# Altium schematic sheet Sheet1.SchDoc
size A3
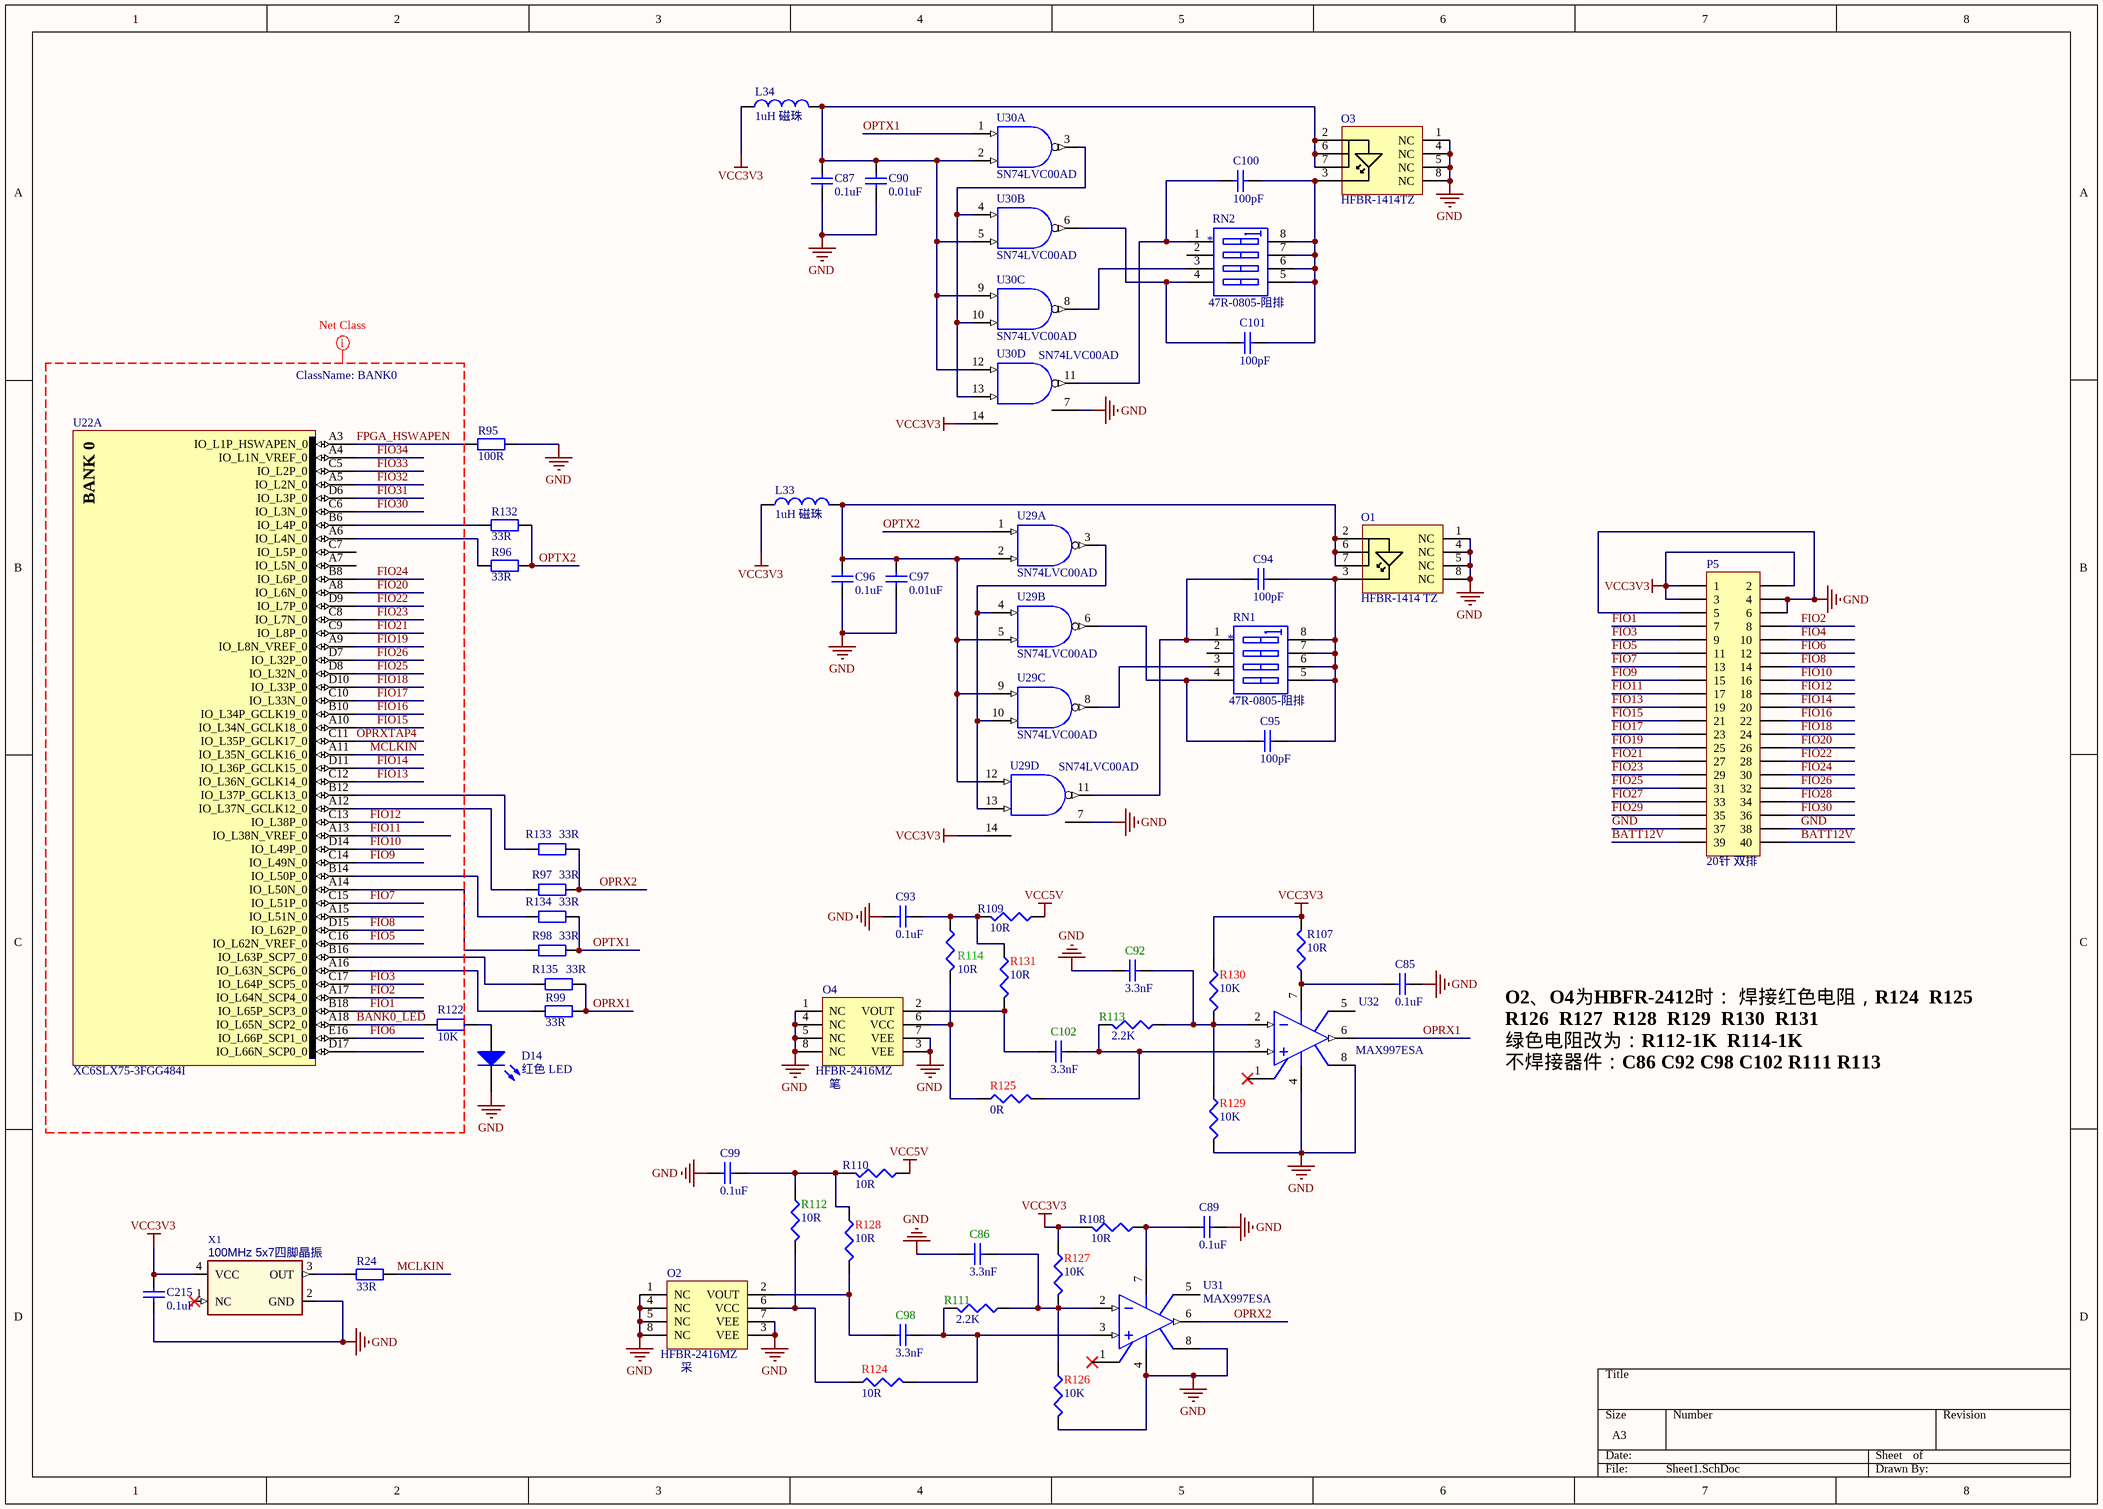
[diagram p0: Sheet1.SchDoc]

## Parts
C85  0.1uF  [0603C]
C86  3.3nF  [0603C]
C87  0.1uF  [0603C]
C89  0.1uF  [0603C]
C90  0.01uF  [0603C]
C92  3.3nF  [0603C]
C93  0.1uF  [0603C]
C94  100pF  [0603C]
C95  100pF  [0603C]
C96  0.1uF  [0603C]
C97  0.01uF  [0603C]
C98  3.3nF  [0603C]
C99  0.1uF  [0603C]
C100  100pF  [0603C]
C101  100pF  [0603C]
C102  3.3nF  [0603C]
C215  0.1uF  [0603C]
D14  红色 LED  [0805LED]
L33  1uH 磁珠  [1206L]
L34  1uH 磁珠  [1206L]
O1  HFBR-1414 TZ  [OPT]
O2  HFBR-2416MZ  [OPT]
O3  HFBR-1414TZ  [OPT]
O4  HFBR-2416MZ  [OPT]
P5  20针 双排  [HEAD2V40]
R24  33R  [0603R]
R95  100R  [0603R]
R96  33R  [0603R]
R97  33R  [0603R]
R98  33R  [0603R]
R99  33R  [0603R]
R107  10R  [0603R]
R108  10R  [0603R]
R109  10R  [0603R]
R110  10R  [0603R]
R111  2.2K  [0603R]
R112  10R  [0603R]
R113  2.2K  [0603R]
R114  10R  [0603R]
R122  10K  [0603R]
R124  10R  [0603R]
R125  0R  [0603R]
R126  10K  [0603R]
R127  10K  [0603R]
R128  10R  [0603R]
R129  10K  [0603R]
R130  10K  [0603R]
R131  10R  [0603R]
R132  33R  [0603R]
R133  33R  [0603R]
R134  33R  [0603R]
R135  33R  [0603R]
RN1  *  [RNS001]
RN2  *  [RNS001]
U22  XC6SLX75-3FGG484I  [FGG484]  (part A of 8)
U29  SN74LVC00AD  [SMD14X]  (parts A,B,C,D of 4)
U30  SN74LVC00AD  [SMD14X]  (parts A,B,C,D of 4)
U31  MAX997ESA  [SMD8XX]
U32  MAX997ESA  [SMD8XX]
X1  100MHz 5x7四脚晶振  [XTALSMD]

## Nets
GND: C85.2 C86.2 C87.2 C89.2 C90.1 C92.2 C93.2 C96.2 C97.1 C99.2 C215.2 D14.2(K) O1.1(NC) O1.4(NC) O1.5(NC) O1.8(NC) O2.1(NC) O2.3(VEE) O2.4(NC) O2.5(NC) O2.7(VEE) O2.8(NC) O3.1(NC) O3.4(NC) O3.5(NC) O3.8(NC) O4.1(NC) O4.3(VEE) O4.4(NC) O4.5(NC) O4.7(VEE) O4.8(NC) P5.4 P5.5 P5.6 P5.37 P5.38 R95.1 R126.2 R129.2 U29.7(GND) U30.7(GND) U31.4(V-) U31.8(EXT_CLKB) U32.4(V-) U32.8(EXT_CLKB) X1.2(GND)
VCC: U29.14(VCC) U30.14(VCC)
VCC3V3: C215.1 L33.1 L34.1 P5.1 P5.2 P5.3 R107.2 R108.2 R127.1 R130.1 U29.14(VCC) U30.14(VCC) X1.4(VCC)
VCC5V: R109.1 R110.1
BANK0_LED: R122.1 U22.A18(IO_L65N_SCP2_0)
BATT12V: P5.39 P5.40
FIO1: P5.7 U22.B18(IO_L65P_SCP3_0)
FIO2: P5.8 U22.A17(IO_L64N_SCP4_0)
FIO3: P5.9 U22.C17(IO_L64P_SCP5_0)
FIO4: P5.10
FIO5: P5.11 U22.C16(IO_L62N_VREF_0)
FIO6: P5.12 U22.E16(IO_L66P_SCP1_0)
FIO7: P5.13 U22.C15(IO_L51P_0)
FIO8: P5.14 U22.D15(IO_L62P_0)
FIO9: P5.15 U22.C14(IO_L49N_0)
FIO10: P5.16 U22.D14(IO_L49P_0)
FIO11: P5.17 U22.A13(IO_L38N_VREF_0)
FIO12: P5.18 U22.C13(IO_L38P_0)
FIO13: P5.19 U22.C12(IO_L36N_GCLK14_0)
FIO14: P5.20 U22.D11(IO_L36P_GCLK15_0)
FIO15: P5.21 U22.A10(IO_L34N_GCLK18_0)
FIO16: P5.22 U22.B10(IO_L34P_GCLK19_0)
FIO17: P5.23 U22.C10(IO_L33N_0)
FIO18: P5.24 U22.D10(IO_L33P_0)
FIO19: P5.25 U22.A9(IO_L8N_VREF_0)
FIO20: P5.26 U22.A8(IO_L6N_0)
FIO21: P5.27 U22.C9(IO_L8P_0)
FIO22: P5.28 U22.D9(IO_L7P_0)
FIO23: P5.29 U22.C8(IO_L7N_0)
FIO24: P5.30 U22.B8(IO_L6P_0)
FIO25: P5.31 U22.D8(IO_L32N_0)
FIO26: P5.32 U22.D7(IO_L32P_0)
FIO27: P5.33
FIO28: P5.34
FIO29: P5.35
FIO30: P5.36 U22.C6(IO_L3N_0)
FIO31: U22.D6(IO_L3P_0)
FIO32: U22.A5(IO_L2N_0)
FIO33: U22.C5(IO_L2P_0)
FIO34: U22.A4(IO_L1N_VREF_0)
FPGA_HSWAPEN: R95.2 U22.A3(IO_L1P_HSWAPEN_0)
MCLKIN: R24.2 U22.A11(IO_L35N_GCLK16_0)
OPRX1: R99.1 R135.1 U32.6(OUT)
OPRX2: R97.1 R133.1 U31.6(OUT)
OPRXTAP4: U22.C11(IO_L35P_GCLK17_0)
OPTX1: R98.1 R134.1 U30.1(A)
OPTX2: R96.1 R132.1 U29.1(A)
NetC85_1: C85.1 R107.1 U32.7(V+)
NetC86_1: C86.1 R111.1 R126.1 R127.2 U31.2(IN-)
NetC87_1: C87.1 C90.2 L34.2 O3.2 O3.6 O3.7 U30.2(B) U30.5(B) U30.9(A) U30.12(A)
NetC89_1: C89.1 R108.1 U31.7(V+)
NetC92_1: C92.1 R113.1 R129.1 R130.2 U32.2(IN-)
NetC93_1: C93.1 R109.2 R114.1 R131.1
NetC94_1: C94.1 C95.1 O1.3 RN1.5(B4) RN1.6(B3) RN1.7(B2) RN1.8(B1)
NetC94_2: C94.2 RN1.1(A1) U29.11(Y)
NetC95_2: C95.2 RN1.4(A4) U29.6(Y)
NetC96_1: C96.1 C97.2 L33.2 O1.2 O1.6 O1.7 U29.2(B) U29.5(B) U29.9(A) U29.12(A)
NetC98_1: C98.1 R111.2 R124.2 U31.3(IN+)
NetC98_2: C98.2 O2.2(VOUT) R128.2
NetC99_1: C99.1 R110.2 R112.1 R128.1
NetC100_1: C100.1 C101.1 O3.3 RN2.5(B4) RN2.6(B3) RN2.7(B2) RN2.8(B1)
NetC100_2: C100.2 RN2.1(A1) U30.11(Y)
NetC101_2: C101.2 RN2.4(A4) U30.6(Y)
NetC102_1: C102.1 R113.2 R125.2 U32.3(IN+)
NetC102_2: C102.2 O4.2(VOUT) R131.2
NetD14_1: D14.1(A) R122.2
NetO2_6: O2.6(VCC) R112.2 R124.1
NetO4_6: O4.6(VCC) R114.2 R125.1
NetR24_1: R24.1 X1.3(OUT)
NetR96_2: R96.2 U22.A6(IO_L4N_0)
NetR97_2: R97.2 U22.A12(IO_L37N_GCLK12_0)
NetR98_2: R98.2 U22.A14(IO_L50N_0)
NetR99_2: R99.2 U22.A16(IO_L63N_SCP6_0)
NetR132_2: R132.2 U22.B6(IO_L4P_0)
NetR133_2: R133.2 U22.B12(IO_L37P_GCLK13_0)
NetR134_2: R134.2 U22.B14(IO_L50P_0)
NetR135_2: R135.2 U22.B16(IO_L63P_SCP7_0)
NetRN1_3: RN1.3(A3) U29.8(Y)
NetRN2_3: RN2.3(A3) U30.8(Y)
NetU29_3: U29.3(Y) U29.4(A) U29.10(B) U29.13(B)
NetU30_3: U30.3(Y) U30.4(A) U30.10(B) U30.13(B)

Not connected (* = marked no-connect by the designer): RN1 2(A2); RN2 2(A2); U22 A7(IO_L5N_0) A15(IO_L51N_0) C7(IO_L5P_0) D17(IO_L66N_SCP0_0); U31 1(EXT_CLKA)* 5(RTN_CLK); U32 1(EXT_CLKA)* 5(RTN_CLK); X1 1(NC)*

## Layout directives
net class BANK0: BANK0_LED, FIO1, FIO2, FIO3, FIO5, FIO6, FIO7, FIO8, FIO9, FIO10, FIO11, FIO12, FIO13, FIO14, FIO15, FIO16, FIO17, FIO18, FIO19, FIO20, FIO21, FIO22, FIO23, FIO24, FIO25, FIO26, FIO30, FIO31, FIO32, FIO33, FIO34, FPGA_HSWAPEN, MCLKIN, OPRXTAP4

## Notes on the sheet
- (near O4) 笔
- O2、O4为HBFR-2412时： 焊接红色电阻，R124  R125  R126  R127  R128  R129  R130  R131
  绿色电阻改为：R112-1K  R114-1K
  不焊接器件：C86 C92 C98 C102 R111 R113
- (near O2) 采
- (in symbol SW DIP-4) 47R-0805-阻排
- (in symbol XC6SLX45-L1FGG484I, part A) BANK 0

## Library data of the parts
C85 C89 C215 = Cap: Capacitor; Published: 8-Jun-2000; LatestRevisionDate: 17-Jul-2002; LatestRevisionNote: Re-released for DXP Platform.; PackageReference: RAD-0.3; Publisher: Altium Limited; Value: 0.1uF
C86 C92 C93 C98 C99 C102 = Cap: Capacitor; Value: ?pF; Published: 8-Jun-2000; LatestRevisionDate: 17-Jul-2002; LatestRevisionNote: Re-released for DXP Platform.; PackageReference: RAD-0.3; Publisher: Altium Limited
C87 C90 C96 C97 = Cap Semi: Capacitor (Semiconductor SIM Model); Value: ?pF; Published: 8-Jun-2000; LatestRevisionDate: 29-May-2009; LatestRevisionNote: IPC-7351 Footprint Added.; PackageReference: C1206; Publisher: Altium Limited; PackageDescription: Chip Capacitor
C94 C95 C100 C101 = Cap Semi: Capacitor (Semiconductor SIM Model); Value: ?uF; Published: 8-Jun-2000; LatestRevisionDate: 29-May-2009; LatestRevisionNote: IPC-7351 Footprint Added.; PackageReference: C1206; Publisher: Altium Limited; PackageDescription: Chip Capacitor
D14 = LED0: Typical INFRARED GaAs LED; Published: 8-Jun-2000; LatestRevisionDate: 08-Jul-2005; LatestRevisionNote: Mech Layer 1 removed.; PackageReference: LED-0; Publisher: Altium Limited
L33 L34 = Inductor: Code_IEC: 1005; Published: 8-Jun-2000; LatestRevisionDate: 29-May-2009; LatestRevisionNote: IPC-7351 Footprint Added.; PackageReference: 0402-A; Publisher: Altium Limited; PackageDescription: Chip Inductor; Code_JEITA: 0402
O1 O3 = HFBR-1414
O2 O4 = OPTO
P5 = MHDR2X20: Header, 20-Pin, Dual row; LatestRevisionDate: 17-Jul-2002; LatestRevisionNote: Re-released for DXP Platform.; Publisher: Altium Limited
R24 R95-R99 R122 R132-R135 = Res2: Resistor; Published: 8-Jun-2000; LatestRevisionDate: 17-Jul-2002; LatestRevisionNote: Re-released for DXP Platform.; PackageReference: AXIAL-0.4; Publisher: Altium Limited
  R24 R96-R99 R132-R135: Value: 33R
  R95: Value: 100R
  R122: Value: 10K
R107-R114 R124 R128 R131 = Res3: Resistor; Published: 8-Jun-2000; LatestRevisionDate: 29-May-2009; LatestRevisionNote: IPC-7351 Footprint Added.; PackageReference: J1-0603; Publisher: Altium Limited; PackageDescription: Chip Resistor
  R107-R110 R112 R114 R124 R128 R131: Value: 10R
  R111 R113: Value: 2.2K
R125-R127 R129 R130 = Res3: Resistor; Value: 10R; Published: 8-Jun-2000; LatestRevisionDate: 29-May-2009; LatestRevisionNote: IPC-7351 Footprint Added.; PackageReference: J1-0603; Publisher: Altium Limited; PackageDescription: Chip Resistor
RN1 RN2 = SW DIP-4: DIP Switch, 4 Position, SPST; Published: 24-Mar-1999; LatestRevisionDate: 29-May-2009; LatestRevisionNote: IPC-7351 Footprint Added.; PackageVersion: Dec-2002; PackageReference: SO8; Publisher: Altium Limited; PackageDescription: 8-Pin Small Outline Integrated Circuit 1.27 mm Pitch; Code_JEDEC: MS-012-AA; Code_IPC: SOIC127P600-8
U22 = XC6SLX45-L1FGG484I: Spartan-6 LX 1.0V FPGA, 316 User I/Os, 484-Ball Fine-Pitch BGA (1.0mm Pitch), Low Power Version, Industrial Grade, Pb-Free; FirstPublished: 17-Nov-2009; DatasheetVersion: ver1.3, Nov-2009; PackageVersion: ver1.1, Dec-2008; PackageReference: FGG484; Publisher: Altium Limited; PackageDescription: 484-Ball Fine Pitch Ball Grid Array 1.00 mm Pitch (FGG484) - Pb-Free; Code_JEDEC: MS-034-AAJ-1; Code_IPC: BGA100P22X22-484; ComponentLink1Description: Spartan-6 Datasheet; ComponentLink1URL: http://www.xilinx.com/support/documentation/data_sheets/ds160.pdf; ComponentLink2Description: Pinout Specification; ComponentLink2URL: http://www.xilinx.com/support/documentation/user_guides/ug385.pdf; ComponentLink3Description: FGG484 Package Drawing; ComponentLink3URL: http://www.xilinx.com/support/documentation/package_specs/fg484.pdf; ComponentLink4Description: Spartan-6 Documents; ComponentLink4URL: http://www.xilinx.com/support/documentation/spartan-6.htm; ComponentLink5Description: Xilinx.com Home; ComponentLink5URL: http://www.xilinx.com
U29 U30 = SN74LVC00AD: Quadruple 2-Input Positive-NAND Gate; Published: 8-Jun-2000; LatestRevisionDate: 13-Apr-2006; LatestRevisionNote: IPC-7351 Footprint Added.; DatasheetVersion: Jun-1998; PackageVersion: Jan-1998; PackageReference: D014; Publisher: Altium Limited; PackageDescription: 14-Pin Small Outline Integrated Circuit 1.27 mm Pitch; Code_IPC: SOIC127P600-14; ComponentLink1Description: Manufacturer Link; ComponentLink1URL: http://www.ti.com/; ComponentLink2Description: Datasheet; ComponentLink2URL: http://www-s.ti.com/sc/ds/SN54LVC00A.pdf
U31 U32 = ICL7650BCSA-1: Chopper Stabilized Operational Amplifier; Published: 16-Jan-2001; LatestRevisionDate: 13-Apr-2006; LatestRevisionNote: IPC-7351 Footprint Added.; DatasheetVersion: Aug-1996; PackageReference: NSO8; Publisher: Altium Limited; PackageDescription: 8-Pin Small Outline Integrated Circuit 1.27 mm Pitch; Code_JEDEC: MS-012-AA; Code_IPC: SOIC127P600-8; ComponentLink1Description: Manufacturer Link; ComponentLink1URL: http://www.maxim-ic.com/; ComponentLink2Description: Datasheet; ComponentLink2URL: http://pdfserv.maxim-ic.com/en/ds/ICL7650-ICL7650B.pdf
X1 = TCXO 20MHz Rakon E5249LF 5x3.2: TCXO, 20MHz, 100ppb, 5x3.2mm SMT, clipped sine o/p; Alternative Parts/Notes: E5074LF; Manufacturer: Rakon; ALS Lib: L3078B; Tolerance: 50ppm; Notes: aka  E5074LF (Ubiquisys-specific part no); CLASS: IC; Volts: 3.3V; Full Part No: E5249LF; Case: 5 x 3.2mm